# EAGLE design portaAberta (EAGLE 9.0.0)
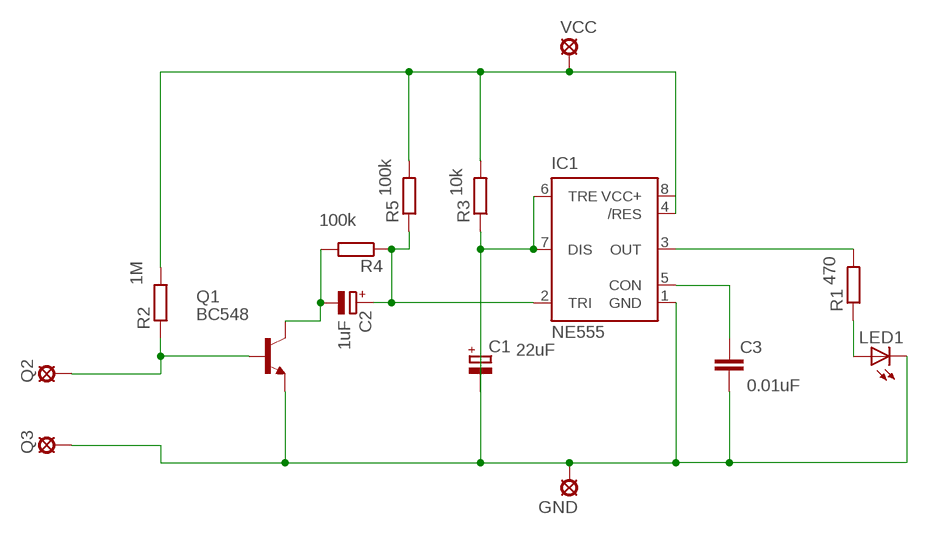
[diagram p0: schematic, sheet 1]

## Parts
C1  CPOL-EUE2.5-6  [E2,5-6]
C2  CPOL-EUE2.5-6  [E2,5-6]
C3  C-EU025-024X044  [C025-024X044]
GND  LSP10  [LSP10]
IC1  NE555  [DIL-08]
LED1  LED5MM  [LED5MM]
Q1  BC548  [TO92-EBC]
Q2  LSP10  [LSP10]
Q3  LSP10  [LSP10]
R1  R-EU_0207/10  [0207/10]
R2  R-EU_0207/10  [0207/10]
R3  R-EU_0207/10  [0207/10]
R4  R-EU_0207/10  [0207/10]
R5  R-EU_0207/10  [0207/10]
VCC  LSP10  [LSP10]

## Nets
9V: IC1.4(/RES) IC1.8(VCC+) R2.2 R3.2 R5.2 VCC.MP
GND: C1.+ C3.2 GND.MP IC1.1(GND) LED1.K(C) Q1.E Q3.MP
N$1: LED1.A R1.1
N$2: IC1.3(OUT) R1.2
N$3: C3.1 IC1.5(CON)
N$4: Q1.B Q2.MP R2.1
N$6: C2.- Q1.C R4.2
N$7: C2.+ IC1.2(TRI) R4.1 R5.1
N$8: C1.- IC1.6(TRE) IC1.7(DIS) R3.1

## Library data of the parts
C1 = rcl:CPOL-EU: POLARIZED CAPACITOR, European symbol; C1: 22uF; SPICEPREFIX: C
C2 = rcl:CPOL-EU: POLARIZED CAPACITOR, European symbol; C2: 1uF; SPICEPREFIX: C
C3 = rcl:C-EU: CAPACITOR, European symbol; C2: 0.01uF; SPICEPREFIX: C
GND Q2 Q3 VCC = solpad:LSP10: SOLDER PAD drill 1.0 mm, distributor Buerklin, 12H555
IC1 = st-microelectronics:NE555: General purpose bipolar Timer; MF: Arrow Electronics; MPN: NE555N; OC_FARNELL: 1467742; OC_NEWARK: 89K1486
LED1 = led:LED: LED OSRAM: - CHIPLED LG R971, LG N971, LY N971, LG Q971, LY Q971, LO R971, LY R971 LH N974, LH R974 LS Q976, LO Q976, LY Q976 LO Q996 - Hyper CHIPLED LW Q18S LB Q993, LB Q99A, LB R99A - SideLED LS A670, LO A670, LY A670, LG A670, LP A670 LB A673, LV A673, LT A673, LW A673 LH A674 LY A675 LS A676, LA A676, LO A676, LY A676, LW A676 LS A679, LY A679, LG A679 - Hyper Micro SIDELED® LS Y876, LA Y876, LO Y876, LY Y876 LT Y87S - SmartLED LW L88C, LW L88S LB L89C, LB L89S, LG L890 LS L89K, LO L89K, LY L89K LS L896, LA L896, LO L896, LY L896 - TOPLED LS T670, LO T670, LY T670, LG T670, LP T670 LSG T670, LSP T670, LSY T670, LOP T670, LYG T670 LG T671, LOG T671, LSG T671 LB T673, LV T673, LT T673, LW T673 LH T674 LS T676, LA T676, LO T676, LY T676, LB T676, LH T676, LSB T676, LW T676 LB T67C, LV T67C, LT T67C, LS T67K, LO T67K, LY T67K, LW E67C LS E67B, LA E67B, LO E67B, LY E67B, LB E67C, LV E67C, LT E67C LW T67C LS T679, LY T679, LG T679 LS T770, LO T770, LY T770, LG T770, LP T770 LB T773, LV T773, LT T773, LW T773 LH T774 LS E675, LA E675, LY E675, LS T675 LS T776, LA T776, LO T776, LY T776, LB T776 LHGB T686 LT T68C, LB T68C - Hyper Mini TOPLED® LB M676 - Mini TOPLED Santana® LG M470 LS M47K, LO M47K, LY M47K Source: http://www.osram.convergy.de LUXEON: - LUMILED® LXK2-PW12-R00, LXK2-PW12-S00, LXK2-PW14-U00, LXK2-PW14-V00 LXK2-PM12-R00, LXK2-PM12-S00, LXK2-PM14-U00 LXK2-PE12-Q00, LXK2-PE12-R00, LXK2-PE12-S00, LXK2-PE14-T00, LXK2-PE14-U00 LXK2-PB12-K00, LXK2-PB12-L00, LXK2-PB12-M00, LXK2-PB14-N00, LXK2-PB14-P00, LXK2-PB14-Q00 LXK2-PR12-L00, LXK2-PR12-M00, LXK2-PR14-Q00, LXK2-PR14-R00 LXK2-PD12-Q00, LXK2-PD12-R00, LXK2-PD12-S00 LXK2-PH12-R00, LXK2-PH12-S00 LXK2-PL12-P00, LXK2-PL12-Q00, LXK2-PL12-R00 Source: www.luxeon.com KINGBRIGHT: KA-3528ASYC Source: www.kingbright.com
Q1 = transistor-npn:BC548*: NPN Transistor
R1 = resistor:R-EU_: RESISTOR, European symbol; R6: 470
R2 = resistor:R-EU_: RESISTOR, European symbol; R2: 1M
R3 = resistor:R-EU_: RESISTOR, European symbol; R4: 10k
R4 = resistor:R-EU_: RESISTOR, European symbol; R1: 100k
R5 = resistor:R-EU_: RESISTOR, European symbol; R3: 100k

## Net classes
0 default: clearance 0.205 mm

## Board
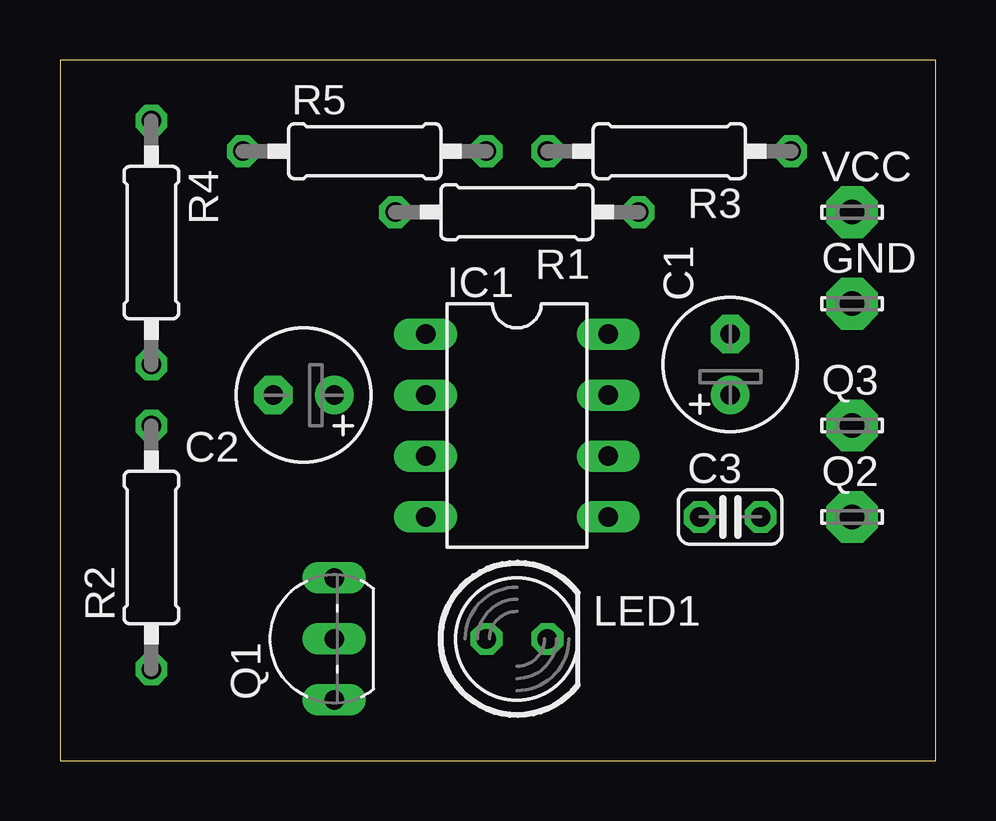
[diagram p1: board, top side]
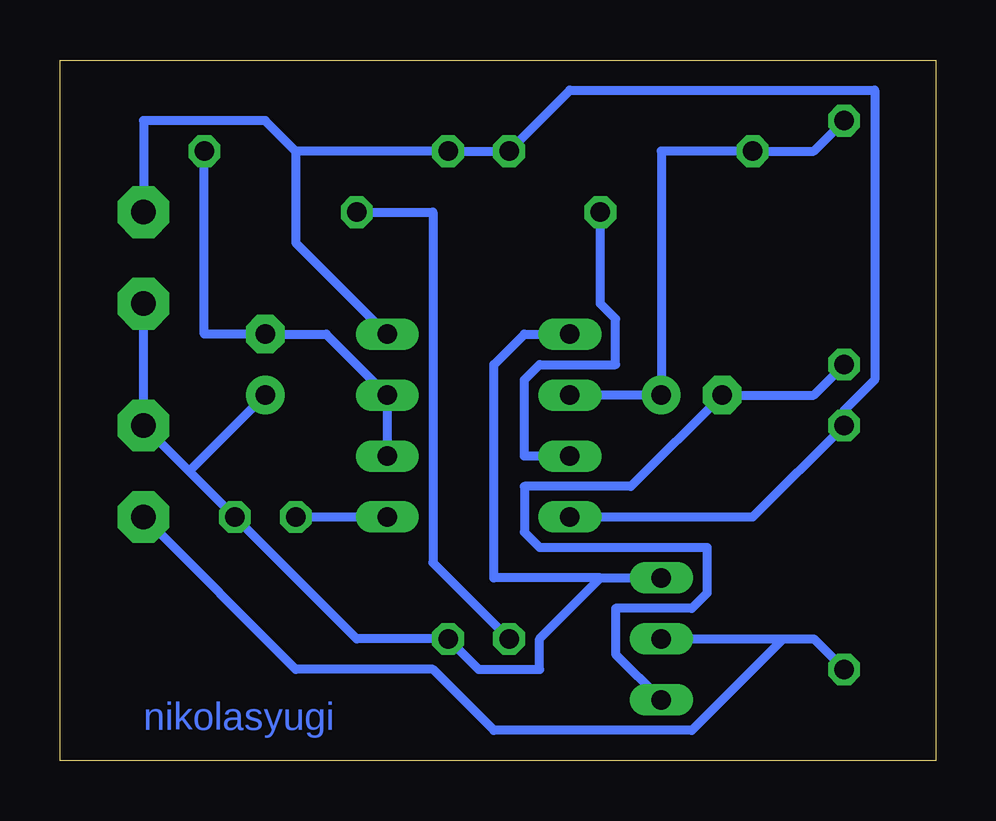
[diagram p2: board, bottom side, seen from below]

Size 36.5 x 29.2 mm. Coordinates in mm from the lower left corner, seen from the top.
Outline: 0,0 36.5,0 36.5,29.2 0,29.2 0,0
Copper layers (1*16): Top 0.035mm / dielectric 1.5mm / Bottom 0.035mm
Design rules "default *": minimum track width 15mil, minimum drill 0.35mm, track to track 30mil, track to pad 12mil, pad to pad 12mil, via to via 12mil, smd to smd 6mil, copper to edge 40mil, drill to drill 6mil, minimum pad ring 10mil, minimum via ring 8mil, stop-mask expansion 4mil, vias tented up to drill 0mil, thermal gap 10mil

### Footprints (pad centres in the part's own frame; a part is rotated, then mirrored left to right if it is on the bottom)
E2,5-6 = drill 0.813 pad 1.6: + -1.27,0 | drill 0.813 pad 1.6 octagon: - 1.27,0
C025-024X044 = drill 0.813 octagon: 1 -1.27,0; 2 1.27,0
LSP10 = drill 1.016 pad 2.159 octagon: MP 0,0
DIL-08 = drill 0.813 long: 1 -3.81,-3.81; 2 -1.27,-3.81; 3 1.27,-3.81; 4 3.81,-3.81; 5 3.81,3.81; 6 1.27,3.81; 7 -1.27,3.81; 8 -3.81,3.81
LED5MM = drill 0.813 octagon: A -1.27,0; K 1.27,0
TO92-EBC = drill 0.813 long: B 0,-1.27; C -2.54,-1.27; E 2.54,-1.27
0207/10 = drill 0.813 octagon: 1 -5.08,0; 2 5.08,0

### Placement (x,y rotation side)
C1  27.94,16.51 90 top
C2  10.16,15.24 180 top
C3  27.94,10.16 0 top
GND  33.02,19.05 0 top
IC1  19.05,13.97 270 top
LED1  19.05,5.08 0 top
Q1  10.16,5.08 90 top
Q2  33.02,10.16 0 top
Q3  33.02,13.97 0 top
R1  19.05,22.86 180 top
R2  3.81,8.89 90 top
R3  25.4,25.4 180 top
R4  3.81,21.59 270 top
R5  12.7,25.4 0 top
VCC  33.02,22.86 0 top

### Tracks (layer width: path | path; a pad name or v marks a point on that pad's centre or on a via)
9V
  Bottom 0.381: IC1.4 7.62,10.16 R2.2 3.81,14.61 2.54,15.88 2.54,27.94 15.24,27.94 R5.2 R3.2 26.67,25.4 | IC1.8 26.67,21.59 26.67,25.4 | VCC.MP 33.02,26.67 27.94,26.67 26.67,25.4
GND
  Bottom 0.381: 31.11,12.06 Q3.MP GND.MP | 31.11,12.06 C3.2 24.13,5.08 LED1.K 19.05,3.81 16.51,3.81 16.51,5.08 13.97,7.62 | 31.11,12.06 C1.+ | 13.97,7.62 Q1.E | IC1.1 17.14,17.78 18.41,16.51 18.41,7.62 13.97,7.62
N$1
  Bottom 0.381: LED1.A 20.95,8.26 20.95,22.86 R1.1
N$2
  Bottom 0.381: R1.2 13.97,19.05 13.34,18.41 13.34,16.51 16.51,16.51 17.14,15.88 17.14,12.7 IC1.3
N$3
  Bottom 0.381: C3.1 IC1.5
N$4
  Bottom 0.381: R2.1 5.08,5.08 6.35,5.08 | Q1.B 6.35,5.08 | Q2.MP 26.67,3.81 20.95,3.81 18.41,1.27 10.16,1.27 6.35,5.08
N$6
  Bottom 0.381: Q1.C 13.34,4.45 13.34,6.35 10.16,6.35 9.53,6.99 9.53,8.89 16.51,8.89 17.14,9.53 17.14,11.43 12.7,11.43 C2.- 5.08,15.24 R4.2
N$7
  Bottom 0.381: IC1.2 C2.+ 11.43,25.4 R5.1 5.08,25.4 R4.1
N$8
  Bottom 0.381: IC1.6 IC1.7 25.4,17.78 C1.- 30.48,17.78 R3.1

### Text on the board
Bottom: nikolasyugi